# Altium schematic sheet TP_IHM_BUZZER.SchDoc
size A4
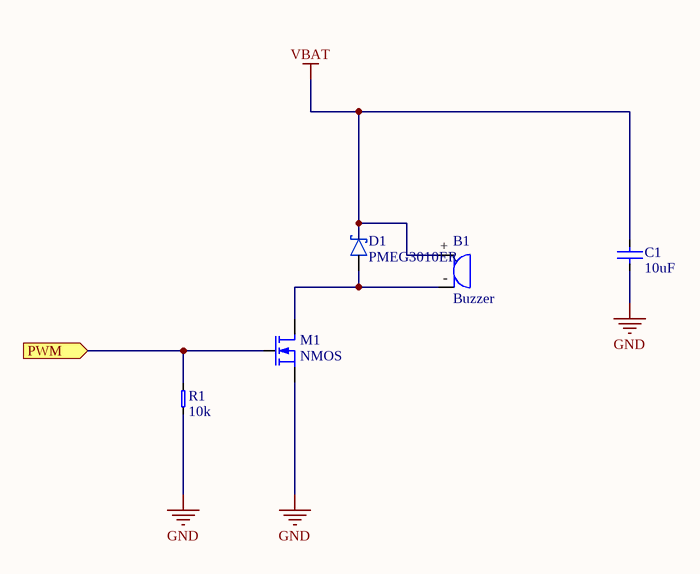
[diagram p0: TP_IHM_BUZZER.SchDoc]

## Parts
B1  Buzzer  [SD160709]
C1  value 10uF  [0603_CAP_LD]  (hidden comment: CerCap)
D1  PMEG3010ER  [SOD123W]
M1  NMOS  [MOSFET-SOT23]
R1  value 10k  [0603_RES_LD]  (hidden comment: Resistor)

## Ports
PWM (in)

## Nets
GND: C1.1 M1.S R1.1
VBAT: B1.+ C1.2 D1.K
PWM: M1.G R1.2 ; port PWM
NetB1_-: B1.- D1.A M1.D

## Library data of the parts
B1 = SD160709: TDK SD160709 Buzzer; Reference: SD160709
C1 = CerCap: Ceramic Capacitor; Type: *; Voltage/Power: *; Package: *
D1 = Schottky_PMEG3010ER: Nexperia 1A low Vf Mega Schottky barrier rectifier; Reference: PMEG3010ER
M1 = N-MOSFET: N MOSFET
R1 = Resistor: Precision: *; Package: *